# EAGLE design shield (EAGLE 6.4)
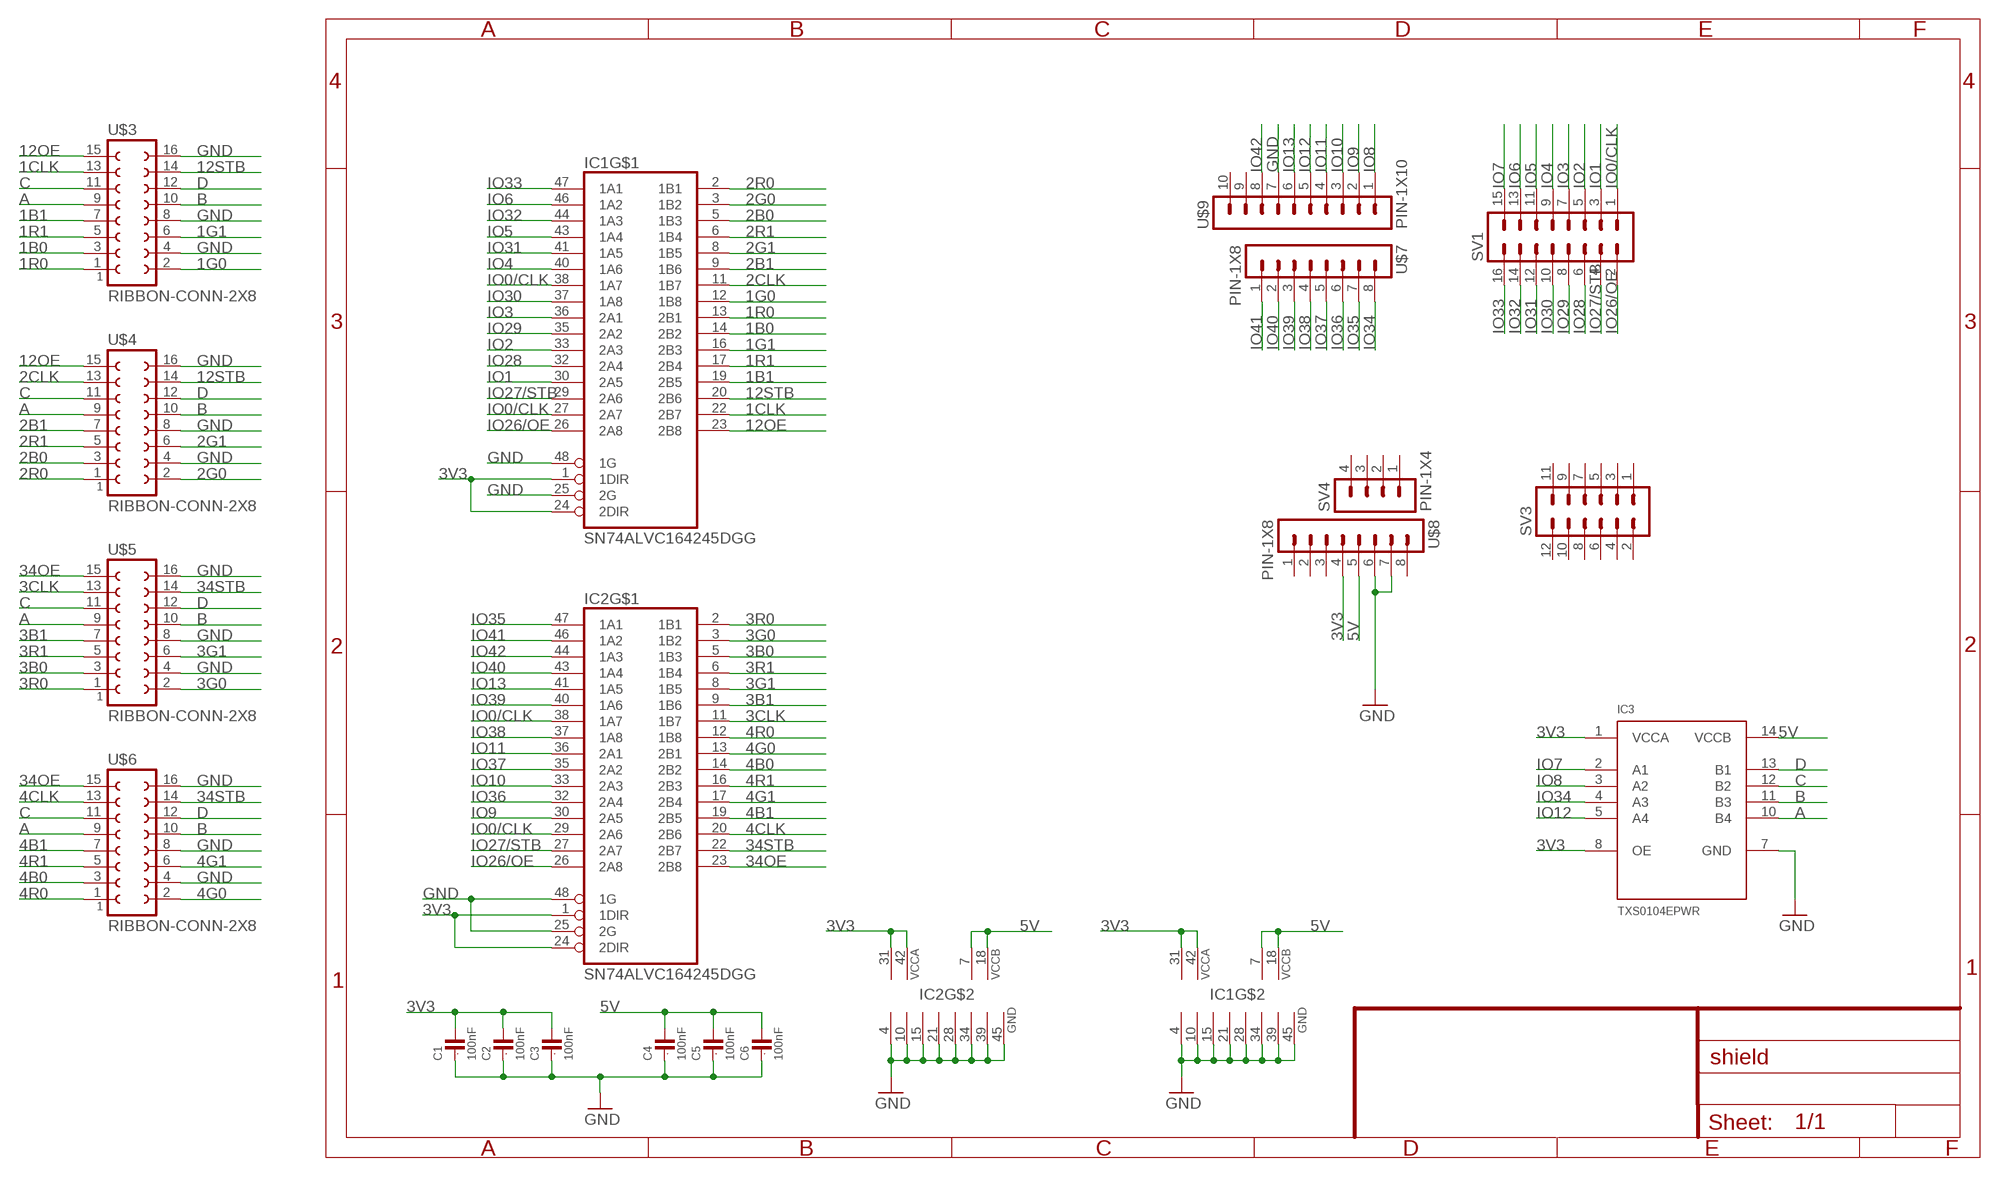
[diagram p0: schematic, sheet 1]

## Parts
C1  100nF  C0603  [0603]
C2  100nF  C0603  [0603]
C3  100nF  C0603  [0603]
C4  100nF  C0603  [0603]
C5  100nF  C0603  [0603]
C6  100nF  C0603  [0603]
IC1  SN74ALVC164245DGG  [TSSOP48]
IC2  SN74ALVC164245DGG  [TSSOP48]
IC3  TXS0104EPWR  [TSSOP14]
SV1  MA08-2  [MA08-2]
SV3  MA06-2  [MA06-2]
SV4  PIN-1X4  [PIN-1X4]
U$3  RIBBON-CONN-2X8  [RIBBON-CONN-2X8]
U$4  RIBBON-CONN-2X8  [RIBBON-CONN-2X8]
U$5  RIBBON-CONN-2X8  [RIBBON-CONN-2X8]
U$6  RIBBON-CONN-2X8  [RIBBON-CONN-2X8]
U$7  PIN-1X8  [PIN-1X8]
U$8  PIN-1X8  [PIN-1X8]
U$9  PIN-1X10  [PIN-1X10]

## Nets
1B0: IC1.14(2B2) U$3.3
1B1: IC1.19(2B5) U$3.7
1CLK: IC1.22(2B7) U$3.13
1G0: IC1.12(1B8) U$3.2
1G1: IC1.16(2B3) U$3.6
1R0: IC1.13(2B1) U$3.1
1R1: IC1.17(2B4) U$3.5
2B0: IC1.5(1B3) U$4.3
2B1: IC1.9(1B6) U$4.7
2CLK: IC1.11(1B7) U$4.13
2G0: IC1.3(1B2) U$4.2
2G1: IC1.8(1B5) U$4.6
2R0: IC1.2(1B1) U$4.1
2R1: IC1.6(1B4) U$4.5
3B0: IC2.5(1B3) U$5.3
3B1: IC2.9(1B6) U$5.7
3CLK: IC2.11(1B7) U$5.13
3G0: IC2.3(1B2) U$5.2
3G1: IC2.8(1B5) U$5.6
3R0: IC2.2(1B1) U$5.1
3R1: IC2.6(1B4) U$5.5
3V3: C1.2 C2.2 C3.2 IC1.1(1DIR) IC1.24(2DIR) IC1.31(VCCA) IC1.42(VCCA) IC2.1(1DIR) IC2.24(2DIR) IC2.31(VCCA) IC2.42(VCCA) IC3.1(VCCA) IC3.8(OE) U$8.4
4B0: IC2.14(2B2) U$6.3
4B1: IC2.19(2B5) U$6.7
4CLK: IC2.20(2B6) U$6.13
4G0: IC2.13(2B1) U$6.2
4G1: IC2.17(2B4) U$6.6
4R0: IC2.12(1B8) U$6.1
4R1: IC2.16(2B3) U$6.5
5V: C4.2 C5.2 C6.2 IC1.7(VCCB) IC1.18(VCCB) IC2.7(VCCB) IC2.18(VCCB) IC3.14(VCCB) U$8.5
12OE: IC1.23(2B8) U$3.15 U$4.15
12STB: IC1.20(2B6) U$3.14 U$4.14
34OE: IC2.23(2B8) U$5.15 U$6.15
34STB: IC2.22(2B7) U$5.14 U$6.14
A: IC3.10(B4) U$3.9 U$4.9 U$5.9 U$6.9
B: IC3.11(B3) U$3.10 U$4.10 U$5.10 U$6.10
C: IC3.12(B2) U$3.11 U$4.11 U$5.11 U$6.11
D: IC3.13(B1) U$3.12 U$4.12 U$5.12 U$6.12
GND: C1.1 C2.1 C3.1 C4.1 C5.1 C6.1 IC1.4(GND) IC1.10(GND) IC1.15(GND) IC1.21(GND) IC1.25(2G) IC1.28(GND) IC1.34(GND) IC1.39(GND) IC1.45(GND) IC1.48(1G) IC2.4(GND) IC2.10(GND) IC2.15(GND) IC2.21(GND) IC2.25(2G) IC2.28(GND) IC2.34(GND) IC2.39(GND) IC2.45(GND) IC2.48(1G) IC3.7(GND) U$3.4 U$3.8 U$3.16 U$4.4 U$4.8 U$4.16 U$5.4 U$5.8 U$5.16 U$6.4 U$6.8 U$6.16 U$8.6 U$8.7 U$9.7
IO0/CLK: IC1.27(2A7) IC1.38(1A7) IC2.29(2A6) IC2.38(1A7) SV1.1
IO1: IC1.30(2A5) SV1.3
IO2: IC1.33(2A3) SV1.5
IO3: IC1.36(2A1) SV1.7
IO4: IC1.40(1A6) SV1.9
IO5: IC1.43(1A4) SV1.11
IO6: IC1.46(1A2) SV1.13
IO7: IC3.2(A1) SV1.15
IO8: IC3.3(A2) U$9.1
IO9: IC2.30(2A5) U$9.2
IO10: IC2.33(2A3) U$9.3
IO11: IC2.36(2A1) U$9.4
IO12: IC3.5(A4) U$9.5
IO13: IC2.41(1A5) U$9.6
IO26/OE: IC1.26(2A8) IC2.26(2A8) SV1.2
IO27/STB: IC1.29(2A6) IC2.27(2A7) SV1.4
IO28: IC1.32(2A4) SV1.6
IO29: IC1.35(2A2) SV1.8
IO30: IC1.37(1A8) SV1.10
IO31: IC1.41(1A5) SV1.12
IO32: IC1.44(1A3) SV1.14
IO33: IC1.47(1A1) SV1.16
IO34: IC3.4(A3) U$7.8
IO35: IC2.47(1A1) U$7.7
IO36: IC2.32(2A4) U$7.6
IO37: IC2.35(2A2) U$7.5
IO38: IC2.37(1A8) U$7.4
IO39: IC2.40(1A6) U$7.3
IO40: IC2.43(1A4) U$7.2
IO41: IC2.46(1A2) U$7.1
IO42: IC2.44(1A3) U$9.8
Unconnected: SV3.1 SV3.2 SV3.3 SV3.4 SV3.5 SV3.6 SV3.7 SV3.8 SV3.9 SV3.10 SV3.11 SV3.12 SV4.1 SV4.2 SV4.3 SV4.4 U$8.1 U$8.2 U$8.3 U$8.8 U$9.9 U$9.10

## Library data of the parts
C1-C6 = GadgetFactory:C: CAPACITOR, European symbol
IC1 IC2 = alvie:SN74ALVC164245
IC3 = alvie:TXS0104E
SV1 = con-lstb:MA08-2: PIN HEADER; OC_FARNELL: unknown; OC_NEWARK: unknown
SV3 = con-lstb:MA06-2: PIN HEADER; OC_FARNELL: unknown; OC_NEWARK: unknown
SV4 = alvie:PIN-1X4
U$3-U$6 = alvie:RIBBON-CONN-2X8
U$7 U$8 = alvie:PIN-1X8
U$9 = alvie:PIN-1X10

## Board
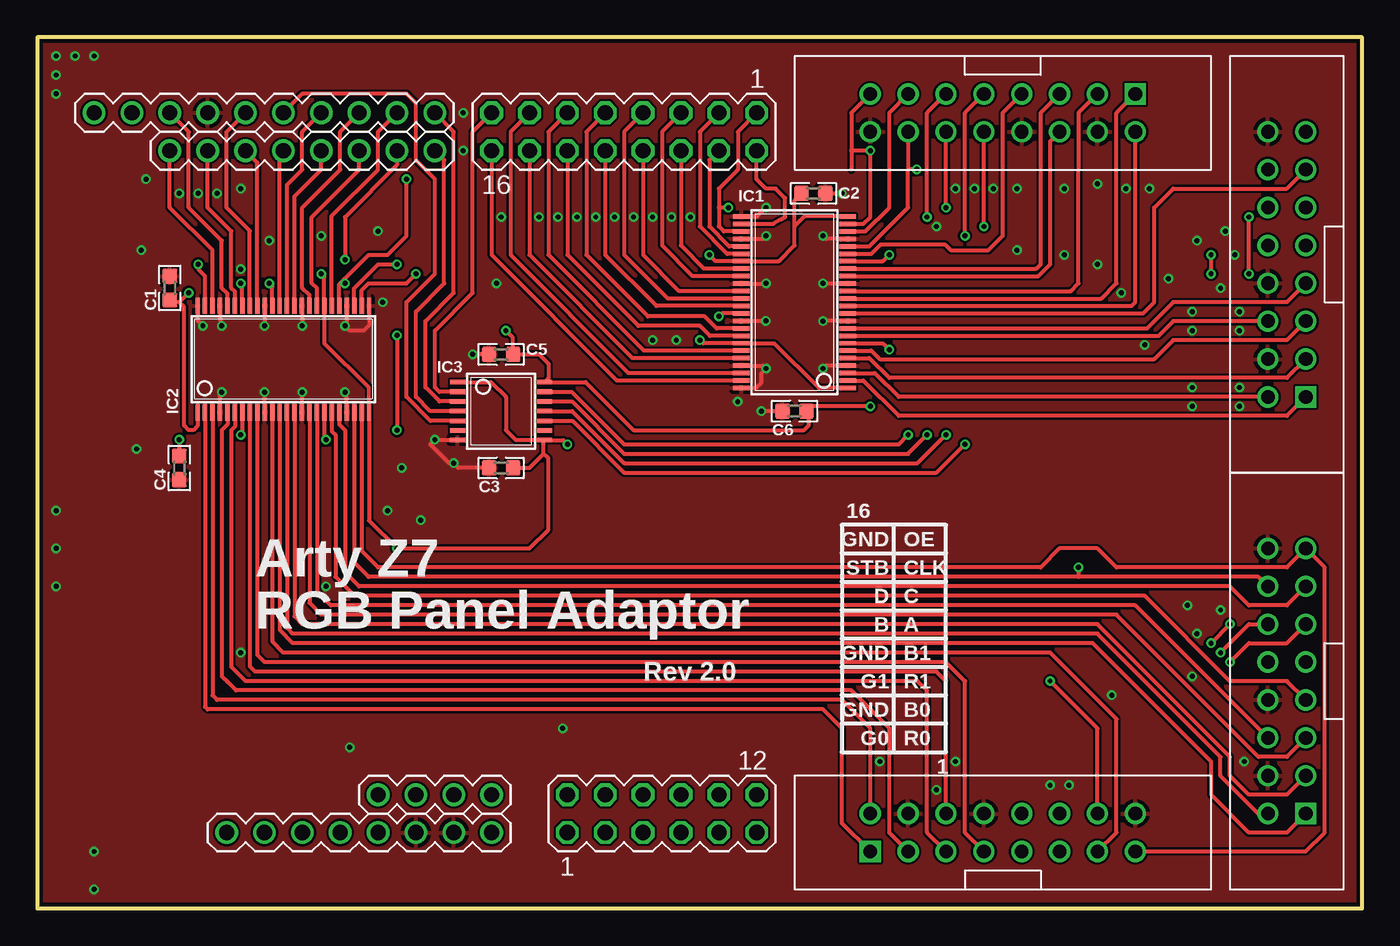
[diagram p1: board, top side]
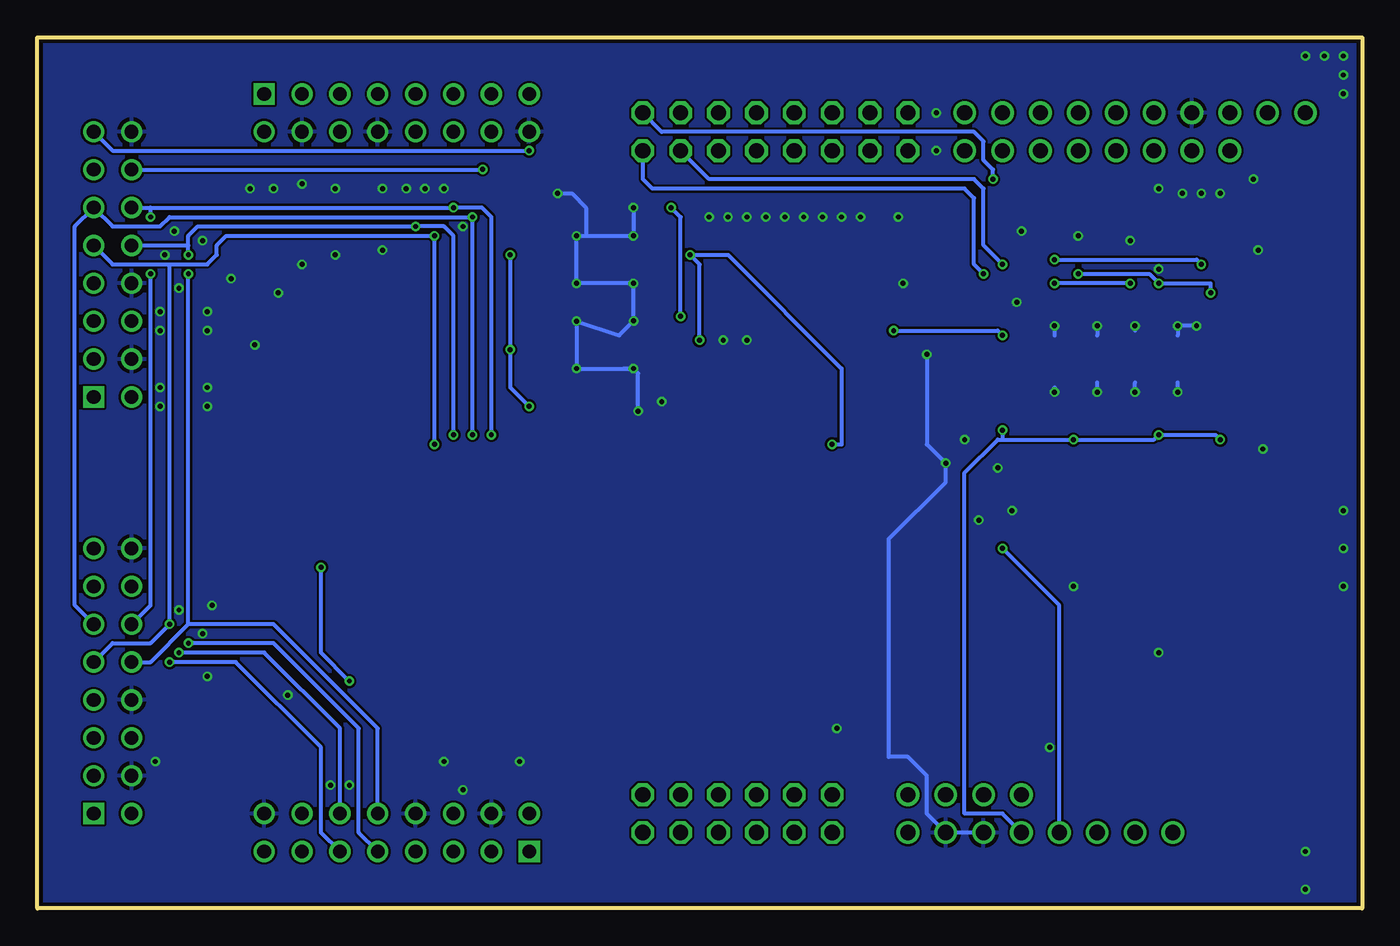
[diagram p2: board, bottom side, seen from below]

Size 88.88 x 58.41 mm. Coordinates in mm from the lower left corner, seen from the top.
Outline: 0,0 88.88,0 88.88,58.41 0,58.41 0,0
Copper layers (1*16): Top 0.035mm / dielectric 1.5mm / Bottom 0.035mm
Design rules "JLCPCB-Single-DualLayer *": minimum track width 6mil, minimum drill 12mil, track to track 6mil, track to pad 6mil, pad to pad 6mil, via to via 6mil, smd to smd 0mil, copper to edge 10mil, drill to drill 10mil, minimum pad ring 10mil, minimum via ring 6mil, stop-mask expansion 2mil, vias tented up to drill 100mil, thermal gap 10mil

### Footprints (pad centres in the part's own frame; a part is rotated, then mirrored left to right if it is on the bottom)
0603 = smd 1 x 1: 1 -0.8,0; 2 0.8,0
TSSOP48 = smd 0.3 x 1.1: 1 -5.75,-3.575; 2 -5.25,-3.575; 3 -4.75,-3.575; 4 -4.25,-3.575; 5 -3.75,-3.575; 6 -3.25,-3.575; 7 -2.75,-3.575; 8 -2.25,-3.575; 9 -1.75,-3.575; 10 -1.25,-3.575; 11 -0.75,-3.575; 12 -0.25,-3.575; 13 0.25,-3.575; 14 0.75,-3.575; 15 1.25,-3.575; 16 1.75,-3.575; 17 2.25,-3.575; 18 2.75,-3.575; 19 3.25,-3.575; 20 3.75,-3.575; 21 4.25,-3.575; 22 4.75,-3.575; 23 5.25,-3.575; 24 5.75,-3.575; 25 5.75,3.575; 26 5.25,3.575; 27 4.75,3.575; 28 4.25,3.575; 29 3.75,3.575; 30 3.25,3.575; 31 2.75,3.575; 32 2.25,3.575; 33 1.75,3.575; 34 1.25,3.575; 35 0.75,3.575; 36 0.25,3.575; 37 -0.25,3.575; 38 -0.75,3.575; 39 -1.25,3.575; 40 -1.75,3.575; 41 -2.25,3.575; 42 -2.75,3.575; 43 -3.25,3.575; 44 -3.75,3.575; 45 -4.25,3.575; 46 -4.75,3.575; 47 -5.25,3.575; 48 -5.75,3.575
TSSOP14 = smd 0.305 x 0.991: 1 -1.95,-2.918; 2 -1.3,-2.918; 3 -0.65,-2.918; 4 0,-2.918; 5 0.65,-2.918; 6 1.3,-2.918; 7 1.95,-2.918; 8 1.95,2.918; 9 1.3,2.918; 10 0.65,2.918; 11 0,2.918; 12 -0.65,2.918; 13 -1.3,2.918; 14 -1.95,2.918
MA08-2 = drill 1.016 octagon: 1 -8.89,-1.27; 2 -8.89,1.27; 3 -6.35,-1.27; 4 -6.35,1.27; 5 -3.81,-1.27; 6 -3.81,1.27; 7 -1.27,-1.27; 8 -1.27,1.27; 9 1.27,-1.27; 10 1.27,1.27; 11 3.81,-1.27; 12 3.81,1.27; 13 6.35,-1.27; 14 6.35,1.27; 15 8.89,-1.27; 16 8.89,1.27
MA06-2 = drill 1.016 octagon: 1 -6.35,-1.27; 2 -6.35,1.27; 3 -3.81,-1.27; 4 -3.81,1.27; 5 -1.27,-1.27; 6 -1.27,1.27; 7 1.27,-1.27; 8 1.27,1.27; 9 3.81,-1.27; 10 3.81,1.27; 11 6.35,-1.27; 12 6.35,1.27
PIN-1X4 = drill 1.016: 1 -3.81,0; 2 -1.27,0; 3 1.27,0; 4 3.81,0
RIBBON-CONN-2X8 = drill 0.914 square: 1 -8.89,-1.27 | drill 0.914: 2 -8.89,1.27; 3 -6.35,-1.27; 4 -6.35,1.27; 5 -3.81,-1.27; 6 -3.81,1.27; 7 -1.27,-1.27; 8 -1.27,1.27; 9 1.27,-1.27; 10 1.27,1.27; 11 3.81,-1.27; 12 3.81,1.27; 13 6.35,-1.27; 14 6.35,1.27; 15 8.89,-1.27; 16 8.89,1.27
PIN-1X8 = drill 1.016: 1 -8.89,0; 2 -6.35,0; 3 -3.81,0; 4 -1.27,0; 5 1.27,0; 6 3.81,0; 7 6.35,0; 8 8.89,0
PIN-1X10 = drill 1.016: 1 -11.43,0; 2 -8.89,0; 3 -6.35,0; 4 -3.81,0; 5 -1.27,0; 6 1.27,0; 7 3.81,0; 8 6.35,0; 9 8.89,0; 10 11.43,0

### Placement (x,y rotation side)
C1  8.89,41.59 270 top
C2  52.07,47.94 180 top
C3  31.11,29.53 0 top
C4  9.53,29.53 90 top
C5  31.11,37.15 0 top
C6  50.8,33.34 0 top
IC1  50.8,40.64 90 top
IC2  16.51,36.83 0 top
IC3  31.11,33.34 270 top
SV1  39.37,52.07 180 top
SV3  41.91,6.35 0 top
SV4  26.67,7.62 0 top
U$3  64.77,53.34 180 top
U$4  83.82,43.18 90 top
U$5  64.77,5.08 0 top
U$6  83.82,15.24 90 top
U$7  17.78,50.8 0 top
U$8  21.59,5.08 0 top
U$9  15.24,53.34 180 top

### Tracks (layer width: path | path; a pad name or v marks a point on that pad's centre or on a via)
1B0
  Top 0.254: U$3.3 69.85,53.34 69.85,50.8 69.85,49.53 69.85,41.91 69.33,41.39 IC1.14
1B1
  Top 0.254: U$3.7 64.77,53.34 64.77,45.09 63.82,44.13 61.28,44.13 60.88,44.52 56.59,44.52 55.95,43.89 IC1.19
1CLK
  Top 0.254: U$3.13 57.15,53.34 57.15,46.99 55.55,45.39 IC1.22
1G0
  Top 0.254: IC1.12 73.41,40.39 73.66,40.64 U$3.2
1G1
  Top 0.254: IC1.16 67.16,42.39 67.94,43.18 67.94,51.44 U$3.6
1R0
  Top 0.254: U$3.1 72.39,53.34 72.39,41.91 71.37,40.89 IC1.13
1R1
  Top 0.254: U$3.5 67.31,53.34 67.31,43.18 67.02,42.89 IC1.17
2B0
  Top 0.254: U$4.3 83.82,35.56 57.15,35.56 55.82,36.89 IC1.5
2B1
  Top 0.254: U$4.7 83.82,40.64 76.2,40.64 74.45,38.89 IC1.9
2CLK
  Top 0.254: IC1.11 74.18,39.89 74.93,40.64 74.93,46.99 76.2,48.26 83.82,48.26 U$4.13
2G0
  Top 0.254: U$4.2 57.78,34.29 56.19,35.89 IC1.3
2G1
  Top 0.254: U$4.6 76.2,39.37 75.22,38.39 IC1.8
2R0
  Top 0.254: U$4.1 83.82,33.02 57.78,33.02 55.41,35.39 IC1.2
2R1
  Top 0.254: U$4.5 83.82,38.1 76.2,38.1 74.93,36.83 56.52,36.83 55.95,37.39 IC1.6
3B0
  Top 0.254: U$5.3 57.15,5.08 57.15,12.06 54.61,14.61 13.34,14.61 12.76,15.18 12.38,15.56 12.38,32.07 12.76,32.45 IC2.5
3B1
  Top 0.254: U$5.7 62.23,5.08 62.23,15.24 60.96,16.51 15.24,16.51 14.76,16.99 IC2.9
3CLK
  Top 0.254: U$5.13 72.39,5.08 72.39,12.7 67.94,17.14 16.51,17.14 15.76,17.89 IC2.11
3G0
  Top 0.254: U$5.2 55.88,12.06 53.98,13.97 12.06,13.97 11.76,14.28 IC2.3
3G1
  Top 0.254: U$5.6 60.96,15.24 60.33,15.88 14.61,15.88 14.26,16.22 IC2.8
3R0
  Top 0.254: U$5.1 53.98,5.71 53.98,12.06 52.7,13.34 11.43,13.34 11.26,13.51 IC2.2
3R1
  Top 0.254: U$5.5 59.69,5.08 59.69,14.61 59.05,15.24 13.97,15.24 13.02,16.19 13.02,32.07 13.26,32.31 IC2.6
3V3  (via drill 0.33)
  Top 0.254: v45.09,43.81 45.51,43.39 IC1.31 49.74,43.39 50.8,44.45 50.8,45.72 | IC3.8 35.29,31.39 v35.56,31.11 | 50.8,45.72 50.8,47.47 C2.2 | v44.45,38.1 44.66,37.89 IC1.42 49.42,37.89 52.42,34.89 IC1.1 | IC2.42 13.76,41.8 v13.65,41.91 | v19.05,42.55 19.26,42.34 IC2.31 19.26,37.89 22.26,34.89 IC2.24 22.26,26 v24.13,24.13 33.02,24.13 34.29,25.4 34.29,30.16 33.97,30.48 | C3.2 33.02,29.53 33.97,30.48 | 33.97,30.48 33.97,31.33 IC3.8 | IC3.1 30.43,35.29 31.43,34.29 31.43,32.07 32.11,31.39 IC3.8 | IC1.24 51.47,46.39 50.8,45.72 | IC2.1 10.76,32.35 10.48,32.07 10.16,32.07 9.84,32.38 9.84,40.32 9.53,40.64 | 9.53,40.64 9.04,40.64 C1.2 | 9.53,40.64 v10.16,41.27
  Bottom 0.254: v35.56,31.11 34.92,31.11 34.92,36.2 42.55,43.81 v45.09,43.81 44.45,43.18 v44.45,38.1 | v19.05,42.55 14.29,42.55 v13.65,41.91 10.16,41.91 v10.16,41.27 | U$8.4 20.32,20.32 v24.13,24.13
4B0
  Top 0.254: U$6.3 83.82,7.62 81.28,7.62 80.01,8.89 80.01,10.16 71.12,19.05 17.78,19.05 17.26,19.57 IC2.14
4B1
  Top 0.254: U$6.7 83.82,15.24 80.01,15.24 74.3,20.95 21.27,20.95 20,22.23 20,31.75 19.76,31.99 IC2.19
4CLK
  Top 0.254: U$6.13 83.82,20.32 81.28,20.32 80.01,21.59 21.59,21.59 20.64,22.54 20.64,32.07 20.26,32.45 IC2.20
4G0
  Top 0.254: U$6.2 81.92,6.35 79.38,8.89 79.38,10.16 71.12,18.41 17.14,18.41 16.76,18.8 IC2.13
4G1
  Top 0.254: U$6.6 73.66,20.32 19.68,20.32 19.37,20.64 19.05,20.95 18.76,21.25 IC2.17
4R0
  Top 0.254: U$6.1 83.82,5.08 81.28,5.08 78.74,7.62 78.74,9.84 70.8,17.78 17.14,17.78 16.26,18.66 IC2.12
4R1
  Top 0.254: U$6.5 83.82,10.16 81.92,10.16 72.39,19.68 19.05,19.68 18.26,20.48 IC2.16
5V  (via drill 0.33)
  Top 0.254: IC1.7 56.73,37.89 v57.15,37.47 | v55.88,33.66 51.92,33.66 C6.2 51.75,33.19 51.75,32.38 51.44,32.07 40.01,32.07 36.78,35.29 IC3.14 34.29,35.55 34.29,36.51 33.66,37.15 C5.2 31.91,38.25 v31.43,38.73 | IC1.18 56.73,43.39 v57.15,43.81 | IC2.7 13.76,31.86 v13.65,31.75 | IC2.18 19.26,31.54 v19.37,31.43 | v9.53,31.43 C4.2 | v24.13,38.42 v24.13,32.07
  Bottom 0.254: U$8.5 24.13,6.35 26.67,6.35 26.67,29.21 24.45,31.43 24.13,31.43 | v55.88,33.66 57.15,34.92 v57.15,37.47 v57.15,43.81 | 24.13,31.43 v19.37,31.43 13.97,31.43 v13.65,31.75 9.84,31.75 v9.53,31.43 | v31.43,38.73 24.45,38.73 v24.13,38.42 | v24.13,32.07 24.13,31.43
12OE  (via drill 0.33)
  Top 0.254: U$3.15 54.61,53.34 54.61,50.8 | 54.61,50.8 54.61,49.53 | 54.61,50.8 v55.88,50.8 55.88,46.35 55.41,45.89 IC1.23
  Bottom 0.254: U$4.15 83.82,50.8 v55.88,50.8
12STB  (via drill 0.33)
  Top 0.254: U$3.14 58.42,49.53 | v59,49.55 58.44,49.55 58.42,49.53 | IC1.20 55.82,44.39 58.42,46.99 58.42,49.53
  Bottom 0.254: U$4.14 59.02,49.53 v59,49.55
34OE
  Top 0.254: IC2.23 21.76,23.96 22.86,22.86 67.31,22.86 68.58,24.13 71.12,24.13 72.39,22.86 83.82,22.86 U$6.15 86.36,22.86 86.36,5.08 85.09,3.81 U$5.15
34STB  (via drill 0.33)
  Top 0.254: U$6.14 81.92,22.23 69.85,22.23 | 69.85,22.23 22.23,22.23 21.26,23.19 IC2.22 | U$5.14 71.12,12.06 v67.94,15.24 | v69.85,22.86 69.85,22.23
  Bottom 0.254: v67.94,15.24 69.85,17.14 v69.85,22.86
A  (via drill 0.33)
  Top 0.254: U$3.9 62.23,53.34 v62.23,45.09 | v78.74,17.78 v80.01,19.05 | IC3.10 35.89,32.69 39.37,29.21 60.33,29.21 v62.23,31.11
  Bottom 0.254: U$4.9 83.82,43.18 80.01,43.18 | 80.01,43.18 77.47,43.18 76.83,43.81 76.83,44.45 76.2,45.09 v62.23,45.09 v62.23,31.11 | U$6.9 83.82,17.78 81.28,17.78 v80.01,19.05 80.01,43.18 | U$5.9 67.31,5.08 67.31,12.06 73.03,17.78 v78.74,17.78
B  (via drill 0.33)
  Top 0.254: v63.5,45.72 U$3.10 | v78.74,42.55 v78.74,43.81 | IC3.11 35.88,33.34 39.37,29.84 59.05,29.84 v60.96,31.75
  Bottom 0.254: U$4.10 78.74,44.45 | 78.74,44.45 78.74,45.09 78.11,45.72 v63.5,45.72 61.59,45.72 60.96,45.09 v60.96,31.75 | U$6.10 81.28,16.51 78.74,19.05 | 78.74,19.05 v78.74,42.55 | v78.74,43.81 78.74,44.45 | U$5.10 66.04,12.06 73.03,19.05 78.74,19.05
C  (via drill 0.33)
  Top 0.254: U$3.11 59.69,53.34 v59.69,46.35 | v80.01,16.51 81.28,17.78 83.82,17.78 U$6.11 | IC3.12 35.86,33.99 39.37,30.48 58.42,30.48 v59.69,31.75
  Bottom 0.254: U$6.11 86.36,20.32 86.36,45.72 U$4.11 83.82,45.72 80.64,45.72 80.01,46.35 v59.69,46.35 v59.69,31.75 | U$5.11 69.85,5.08 69.85,10.79 75.56,16.51 v80.01,16.51
D  (via drill 0.33)
  Top 0.254: v60.96,46.99 U$3.12 | v81.28,42.55 v81.28,46.35 | IC3.13 35.85,34.64 39.37,31.11 57.78,31.11 v58.42,31.75 | v79.38,17.14 81.28,19.05 U$6.12
  Bottom 0.254: U$4.12 81.28,46.99 | 81.28,46.99 v60.96,46.99 59.05,46.99 58.42,46.35 v58.42,31.75 | U$6.12 81.28,20.32 v81.28,42.55 | v81.28,46.35 81.28,46.99 | U$5.12 68.58,12.06 73.66,17.14 v79.38,17.14
GND  (via drill 0.33)
  Top 0.254: IC1.28 48.7,44.89 v48.9,45.09 | IC1.34 48.88,41.89 v48.9,41.91 | IC1.39 v48.88,39.39 | IC1.21 52.9,44.89 v52.7,45.09 | IC1.15 52.73,41.89 v52.7,41.91 | IC1.10 52.73,39.39 v52.7,39.37 | IC1.45 48.7,36.39 v48.9,36.2 48.58,35.88 48.58,35.24 48.23,34.89 IC1.48 | IC1.4 52.9,36.39 v52.7,36.2 | C2.1 v53.98,47.94 | C6.1 v48.58,33.34 | IC2.45 12.26,39.17 v12.38,39.05 | IC2.39 15.26,39.07 v15.24,39.05 | IC2.34 17.76,39.07 v17.78,39.05 | IC2.28 20.76,39.17 v20.64,39.05 20.95,38.73 21.91,38.73 22.26,39.09 IC2.25 | IC2.4 12.26,34.48 v12.38,34.61 | IC2.10 15.26,34.59 v15.24,34.61 | IC2.15 17.76,34.59 v17.78,34.61 | IC2.21 20.76,34.48 v20.64,34.61 | C5.1 v29.21,37.15 | IC3.7 26.62,31.39 26.35,31.11 27.62,29.84 v27.94,29.84 28.26,29.53 C3.1 | IC1.25 48.3,46.39 v48.9,46.99 | IC2.48 10.76,39.41 v11.11,39.05
  Bottom 0.254: U$8.6 U$8.7 29.21,6.35 29.21,8.89 30.48,10.16 31.75,10.16 31.75,24.77 27.94,28.57 v27.94,29.84 29.21,31.11 v29.21,37.15 | 52.07,45.09 v52.7,45.09 v52.7,41.91 v48.9,41.91 48.88,41.89 v48.88,39.39 49.85,38.42 v52.7,39.37 v52.7,36.2 v48.9,36.2 | v48.9,36.2 49.53,36.2 | v53.98,47.94 53.02,47.94 52.07,46.99 52.07,45.09 | 52.07,45.09 v48.9,45.09 v48.9,46.99 | v48.58,33.34 48.58,35.88 v48.9,36.2 | 12.38,38.42 v12.38,39.05 v11.11,39.05 | v15.24,39.05 15.24,38.73 | v17.78,39.05 17.78,38.42 | v20.64,39.05 20.64,38.42 | v12.38,34.61 12.38,35.24 | v15.24,34.61 15.24,35.24 | v17.78,34.61 17.78,35.24 | v20.64,34.61 20.64,34.92
  other vias: 6.67,30.8 23.5,26.67 24.45,29.53 71.12,48.58 60.33,45.72 25.72,26.04 56.52,9.84 60.33,7.94 19.37,21.59 26.67,31.43 20.95,10.79 13.65,17.14 35.24,12.06 61.59,9.84 6.99,44.13 28.57,50.8 15.56,44.77 30.8,41.91 13.65,48.26 7.3,48.9 19.05,45.09 28.57,53.34 22.86,45.4 71.12,43.18 62.87,48.26 61.59,48.26 3.81,1.27 3.81,3.81 1.27,26.67 1.27,24.13 1.27,21.59 2.54,57.15 1.27,57.15 1.27,55.88 3.81,57.15 1.27,54.61 68.9,48.26 68.9,43.81 65.72,44.13 74.3,37.78 80.64,38.73 80.64,34.92 80.64,33.66 77.47,33.66 77.47,34.92 77.47,38.73 77.47,40.01 80.64,40.01 79.38,41.59 79.38,20 77.15,20.32 77.79,18.41 77.47,15.56 80.96,9.84 72.07,14.29 69.22,8.26 67.94,8.26 64.14,48.26 65.72,48.26 73.03,48.26 74.61,48.26 72.71,41.27 75.88,42.23 33.66,46.35 34.92,46.35 36.2,46.35 37.47,46.35 38.73,46.35 40.01,46.35 41.27,46.35 42.55,46.35 43.81,46.35 41.27,38.1 42.86,38.1 31.11,46.35 9.53,47.94 10.79,47.94 12.06,47.94 13.65,42.86 77.79,44.77 79.69,45.4 80.33,43.81 23.18,40.64 46.99,33.97
  pour Bottom: 0,58.42 88.9,58.42 88.9,0 0,0
  pour Top: 0,58.42 88.9,58.42 88.9,0 0,0
IO0/CLK  (via drill 0.33)
  Top 0.254: SV1.1 46.99,52.07 46.99,49.53 45.72,48.26 45.72,46.99 | 45.72,46.99 45.72,45.72 46.05,45.39 IC1.27 | IC1.38 45.92,39.89 v45.72,39.69 | v46.35,46.99 45.72,46.99 | IC2.29 20.26,41.85 20.48,42.07 | 20.48,42.07 22.23,43.81 23.5,43.81 24.77,45.09 v24.77,48.9 | IC2.38 15.76,41.71 v15.56,41.91 | v20.64,41.91 20.48,42.07
  Bottom 0.254: v45.72,39.69 45.72,46.35 v46.35,46.99 | v24.77,48.9 24.77,49.53 25.4,50.16 25.4,51.44 26.04,52.07 46.99,52.07 SV1.1 | v15.56,41.91 v20.64,41.91
IO1
  Top 0.254: SV1.3 44.45,52.07 44.45,45.72 46.28,43.89 IC1.30
IO2
  Top 0.254: SV1.5 41.91,52.07 41.91,44.45 43.97,42.39 IC1.33
IO3
  Top 0.254: SV1.7 39.37,52.07 39.37,43.81 42.3,40.89 IC1.36
IO4
  Top 0.254: SV1.9 36.83,52.07 36.83,43.81 40.96,39.69 44.77,39.69 45.56,38.89 IC1.40
IO5
  Top 0.254: SV1.11 34.29,52.07 34.29,43.81 40.72,37.39 IC1.43
IO6
  Top 0.254: SV1.13 31.75,52.07 31.75,43.81 39.67,35.89 IC1.46
IO7
  Top 0.254: IC3.2 26.96,34.64 26.67,34.92 26.67,38.73 29.21,41.27 29.21,52.07 SV1.15
IO8
  Top 0.254: IC3.3 26.97,33.99 26.04,34.92 26.04,39.37 27.94,41.27 27.94,52.07 U$9.1
IO9
  Top 0.254: IC2.30 19.76,46.43 22.86,49.53 22.86,52.07 U$9.2
IO10
  Top 0.254: IC2.33 18.26,41.11 17.78,41.59 17.78,46.99 17.94,47.15 18.1,47.31 20.32,49.53 20.32,52.07 U$9.3
IO11
  Top 0.254: IC2.36 16.76,48.51 17.78,49.53 17.78,52.07 U$9.4
IO12
  Top 0.254: IC3.5 26.37,32.69 24.77,34.29 24.77,40.64 26.67,42.55 26.67,48.9 25.4,50.16 25.4,53.98 24.77,54.61 17.78,54.61 U$9.5
IO13
  Top 0.254: IC2.41 14.26,45.43 12.7,46.99 12.7,52.07 U$9.6
IO26/OE  (via drill 0.33)
  Top 0.254: IC1.26 49.36,45.89 49.89,46.2 50.16,46.35 50.16,47.62 49.53,48.26 48.9,48.26 48.26,48.9 SV1.2 | IC2.26 21.76,41.45 22.23,41.91 24.77,41.91 v25.4,42.55
  Bottom 0.254: v25.4,42.55 26.04,43.18 26.04,47.62 26.67,48.26 47.62,48.26 48.26,48.9 SV1.2
IO27/STB  (via drill 0.33)
  Top 0.254: SV1.4 45.09,50.16 45.09,45.72 46.41,44.39 IC1.29 | IC2.27 21.26,41.58 22.86,43.18 v24.13,43.18
  Bottom 0.254: v24.13,43.18 25.4,44.45 25.4,48.26 26.04,48.9 43.81,48.9 SV1.4
IO28
  Top 0.254: SV1.6 43.18,44.45 44.74,42.89 IC1.32
IO29
  Top 0.254: SV1.8 40.64,43.81 43.06,41.39 IC1.35
IO30
  Top 0.254: SV1.10 38.1,43.81 41.52,40.39 IC1.37
IO31
  Top 0.254: SV1.12 35.56,43.81 40.32,39.05 44.45,39.05 45.11,38.39 IC1.41
IO32
  Top 0.254: SV1.14 33.02,43.81 39.95,36.89 IC1.44
IO33
  Top 0.254: SV1.16 30.48,43.81 38.91,35.39 IC1.47
IO34
  Top 0.254: IC3.4 26.35,33.34 25.4,34.29 25.4,40.01 27.3,41.91 27.3,50.16 U$7.8
IO35  (via drill 0.33)
  Top 0.254: U$7.7 24.13,49.85 20.64,46.35 v20.64,43.5 | v10.79,43.18 10.79,42.86 11.26,42.4 IC2.47
  Bottom 0.254: v20.64,43.5 11.11,43.5 v10.79,43.18
IO36
  Top 0.254: IC2.32 18.76,41.56 18.41,41.91 18.41,46.35 21.59,49.53 U$7.6
IO37
  Top 0.254: IC2.35 17.26,47.74 19.05,49.53 U$7.5
IO38
  Top 0.254: IC2.37 16.26,50.55 U$7.4
IO39
  Top 0.254: IC2.40 14.76,50.01 U$7.3
IO40
  Top 0.254: IC2.43 13.26,41.35 13.02,41.59 13.02,45.4 11.43,46.99 U$7.2
IO41
  Top 0.254: IC2.46 11.76,44.12 8.89,46.99 U$7.1
IO42
  Top 0.254: IC2.44 12.76,41.22 12.38,41.59 12.38,44.77 10.16,46.99 10.16,52.07 U$9.8

### Text on the board
tNames: 16 | GND | OE | STB | CLK | Arty Z7 | D | C | RGB Panel Adaptor | B | A | GND | B1 | Rev 2.0 | G1 | R1 | GND | B0 | G0 | R0 | 1